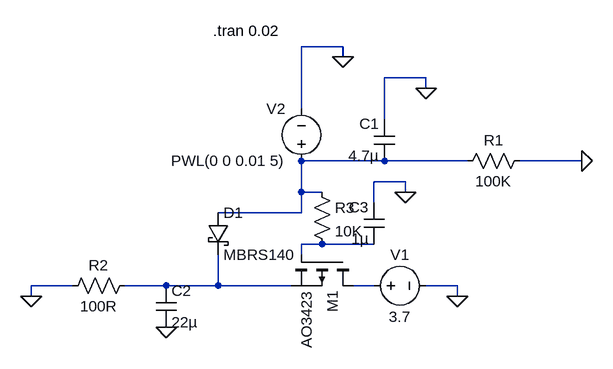
[diagram p0: schematic power path.asc]
power path.asc, the LTspice schematic file:
Version 4.1
SHEET 1 880 680
WIRE 240 -240 176 -240
WIRE 240 -224 240 -240
WIRE 368 -192 304 -192
WIRE 368 -176 368 -192
WIRE 176 -144 176 -240
WIRE 304 -128 304 -192
WIRE 304 -64 176 -64
WIRE 432 -64 304 -64
WIRE 608 -64 512 -64
WIRE 336 -32 288 -32
WIRE 176 -16 176 -64
WIRE 208 -16 176 -16
WIRE 336 -16 336 -32
WIRE 288 0 288 -32
WIRE 176 16 176 -16
WIRE 176 16 48 16
WIRE 208 64 176 64
WIRE 288 64 208 64
WIRE 176 80 176 64
WIRE -176 128 -240 128
WIRE -32 128 -96 128
WIRE 48 128 48 80
WIRE 48 128 -32 128
WIRE 160 128 48 128
WIRE 288 128 256 128
WIRE 416 128 368 128
WIRE -240 144 -240 128
WIRE 416 144 416 128
FLAG 608 -64 0
FLAG -32 192 0
FLAG 416 144 0
FLAG 240 -224 0
FLAG -240 144 0
FLAG 368 -176 0
FLAG 336 -16 0
SYMBOL pmos 256 80 R90
SYMATTR InstName M1
SYMATTR Value AO3423
SYMBOL voltage 272 128 R270
WINDOW 0 32 56 VTop 2
WINDOW 3 -32 56 VBottom 2
WINDOW 123 0 0 Left 0
WINDOW 39 0 0 Left 0
SYMATTR InstName V1
SYMATTR Value 3.7
SYMBOL voltage 176 -48 R180
WINDOW 0 24 96 Left 2
WINDOW 3 24 16 Left 2
WINDOW 123 0 0 Left 0
WINDOW 39 0 0 Left 0
SYMATTR InstName V2
SYMATTR Value PWL(0 0 0.01 5)
SYMBOL cap 320 -64 R180
WINDOW 0 24 57 Left 2
WINDOW 3 24 8 Left 2
SYMATTR InstName C1
SYMATTR Value 4.7µ
SYMATTR Description Capacitor
SYMATTR Type cap
SYMATTR SpiceLine V=10 Irms=0 Rser=4 Lser=0 mfg="AVX" pn="TAJB475M010" type="Tantalum"
SYMBOL res 528 -80 R90
WINDOW 0 0 56 VBottom 2
WINDOW 3 32 56 VTop 2
SYMATTR InstName R1
SYMATTR Value 100K
SYMATTR SpiceLine tol=1 pwr=0.1
SYMBOL schottky 32 16 R0
SYMATTR InstName D1
SYMATTR Value MBRS140
SYMATTR Description Diode
SYMATTR Type diode
SYMBOL cap -48 128 R0
WINDOW 3 24 56 Left 2
SYMATTR InstName C2
SYMATTR Value 22µ
SYMATTR Description Capacitor
SYMATTR Type cap
SYMATTR SpiceLine V=16 Irms=0 Rser=1.6 Lser=0 mfg="AVX" pn="TAJC226K016" type="Tantalum"
SYMBOL res -80 112 R90
WINDOW 0 0 56 VBottom 2
WINDOW 3 32 56 VTop 2
SYMATTR InstName R2
SYMATTR Value 100R
SYMBOL res 192 -32 R0
SYMATTR InstName R3
SYMATTR Value 10K
SYMATTR SpiceLine tol=1 pwr=0.1
SYMBOL cap 304 64 R180
WINDOW 0 24 57 Left 2
WINDOW 3 24 8 Left 2
SYMATTR InstName C3
SYMATTR Value 1µ
SYMATTR Description Capacitor
SYMATTR Type cap
SYMATTR SpiceLine V=16 Irms=0 Rser=11 Lser=0
TEXT 40 -264 Left 2 !.tran 0.02

The netlist it stands for:
* power path.asc
M1 N004 N002 N003 N003 AO3423
V1 N004 0 3.7
V2 N001 0 PWL(0 0 0.01 5)
C1 N001 0 4.7µ V=10 Irms=0 Rser=4 Lser=0 mfg="AVX" pn="TAJB475M010" type="Tantalum"
R1 0 N001 100K tol=1 pwr=0.1
D1 N001 N003 MBRS140
C2 N003 0 22µ V=16 Irms=0 Rser=1.6 Lser=0 mfg="AVX" pn="TAJC226K016" type="Tantalum"
R2 N003 0 100R
R3 N001 N002 10K tol=1 pwr=0.1
C3 N002 0 1µ V=16 Irms=0 Rser=11 Lser=0
.model D D
.lib standard.dio
.model NMOS NMOS
.model PMOS PMOS
.lib standard.mos
.tran 0.02
.backanno
.end